# EAGLE design easyDRO_final (EAGLE 7.5.0)
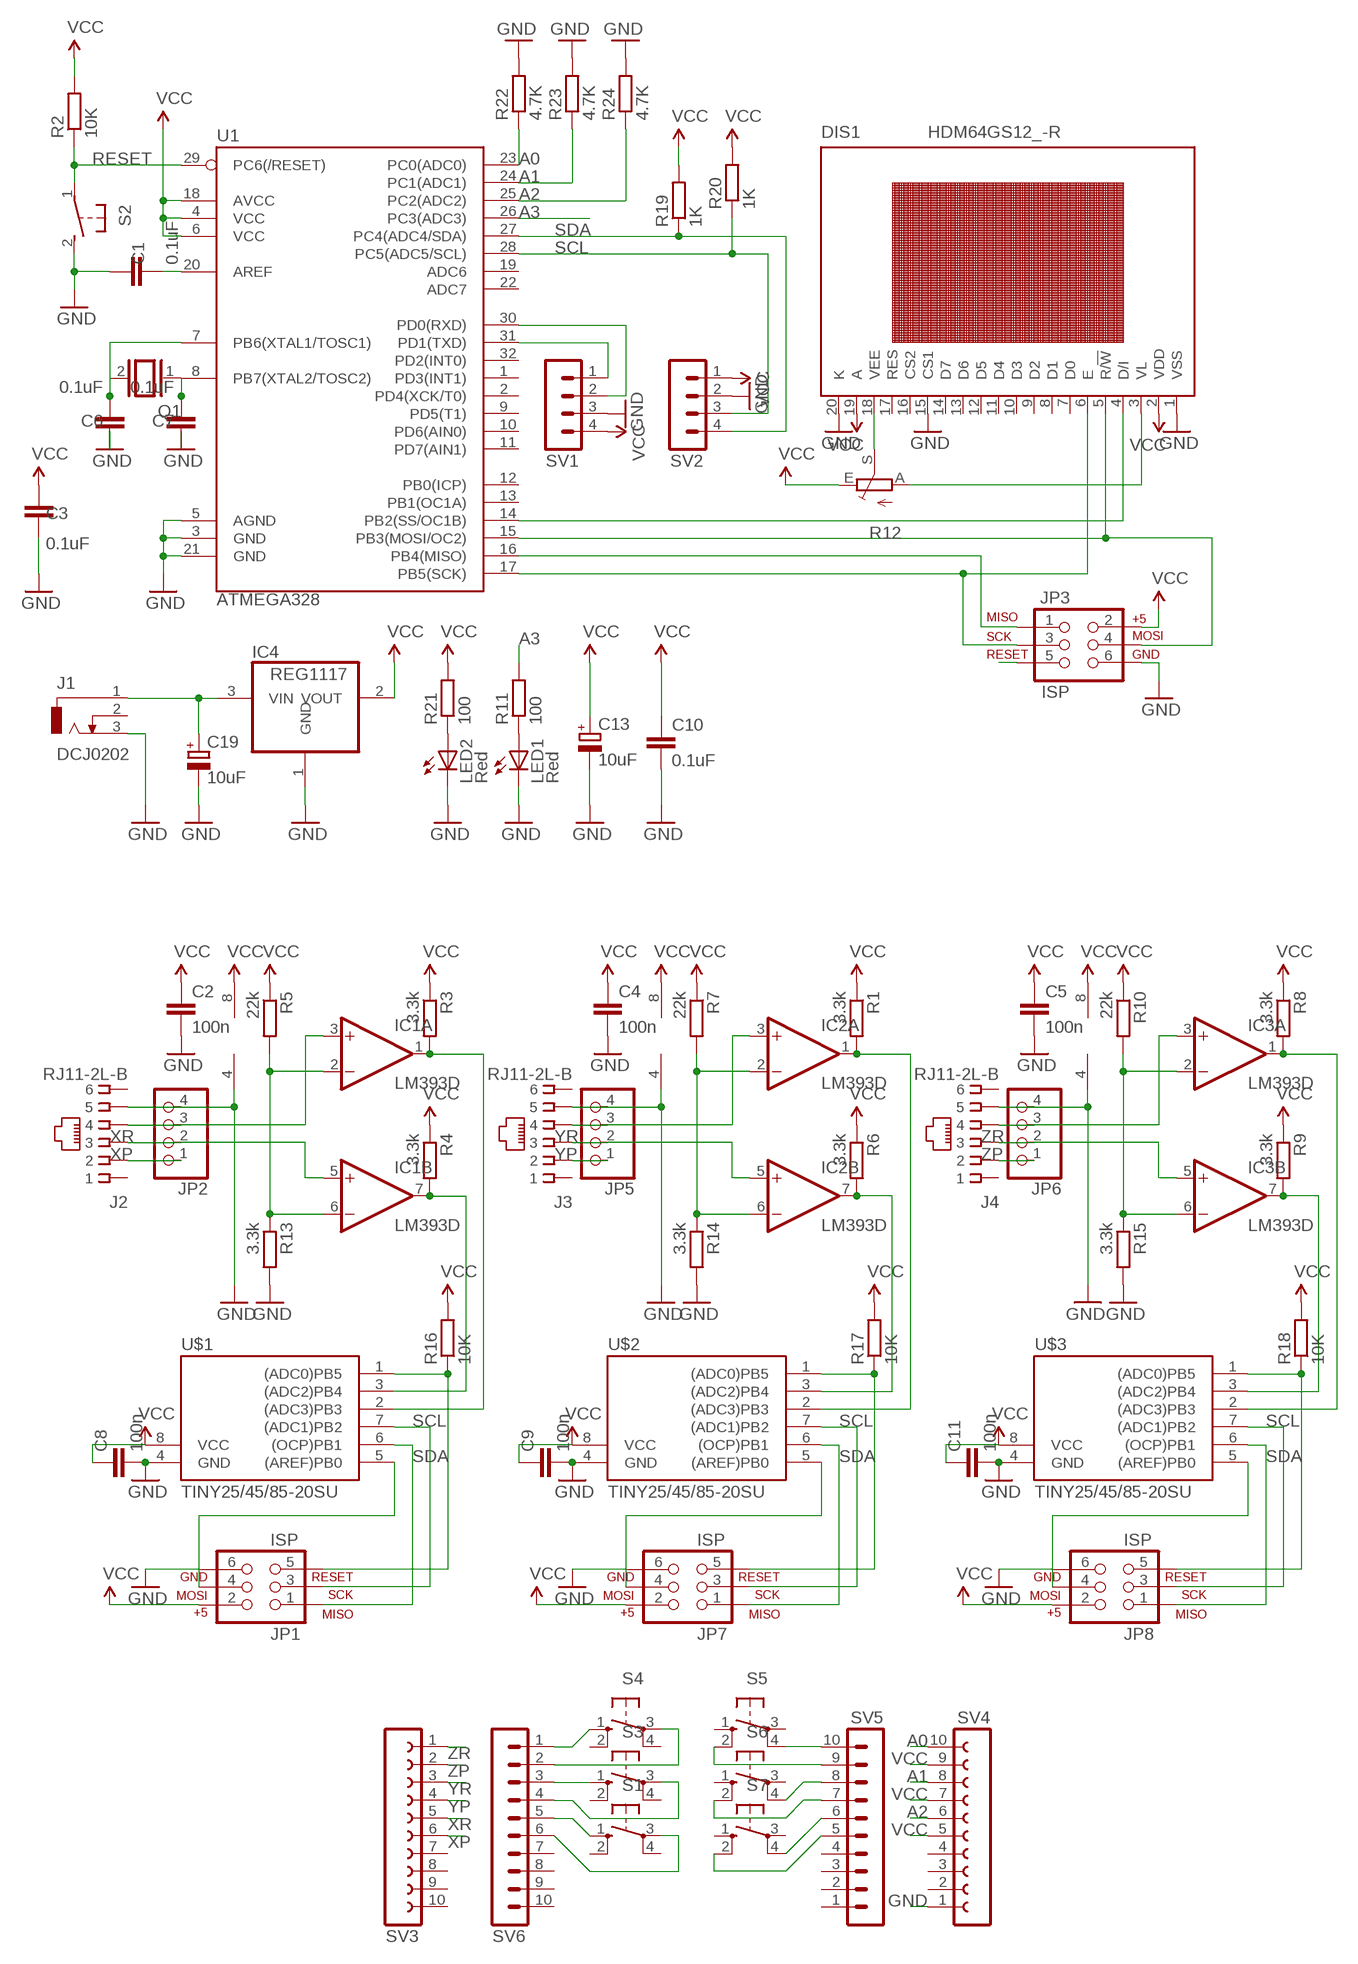
[diagram p0: schematic, sheet 1]

## Parts
C1  0.1uF  C-EUC0805  [C0805]
C2  100n  C-EUC0805  [C0805]
C3  0.1uF  C-EUC0805  [C0805]
C4  100n  C-EUC0805  [C0805]
C5  100n  C-EUC0805  [C0805]
C6  0.1uF  C-EUC0805  [C0805]
C7  0.1uF  C-EUC0805  [C0805]
C8  100n  C-EUC0805  [C0805]
C9  100n  C-EUC0805  [C0805]
C10  0.1uF  C-EUC0805  [C0805]
C11  100n  C-EUC0805  [C0805]
C13  10uF  CPOL-EUE2.5-5  [E2,5-5]
C19  10uF  CPOL-EUE2.5-5  [E2,5-5]
DIS1  HDM64GS12_-R  [HDM64GS12_-R]
IC1  LM393D  [SO08]
IC2  LM393D  [SO08]
IC3  LM393D  [SO08]
IC4  REG1117  [SOT223]
J1  DCJ0202  [DCJ0202]
J2  RJ11-2L-B  [RJ11-NO_SHIELD]
J3  RJ11-2L-B  [RJ11-NO_SHIELD]
J4  RJ11-2L-B  [RJ11-NO_SHIELD]
JP1  ISP  AVR_SPI_PRG_6PTH  [2X3]
JP2  PINHD-1X4/90  [1X04/90]
JP3  ISP  AVR_SPI_PRG_6PTH  [2X3]
JP5  PINHD-1X4/90  [1X04/90]
JP6  PINHD-1X4/90  [1X04/90]
JP7  ISP  AVR_SPI_PRG_6PTH  [2X3]
JP8  ISP  AVR_SPI_PRG_6PTH  [2X3]
LED1  Red  LED5MM  [LED5MM]
LED2  Red  LED5MM  [LED5MM]
Q1  XTAL/S  [QS]
R1  3.3k  R-EU_R0805  [R0805]
R2  10K  R-EU_R0805  [R0805]
R3  3.3k  R-EU_R0805  [R0805]
R4  3.3k  R-EU_R0805  [R0805]
R5  22k  R-EU_R0805  [R0805]
R6  3.3k  R-EU_R0805  [R0805]
R7  22k  R-EU_R0805  [R0805]
R8  3.3k  R-EU_R0805  [R0805]
R9  3.3k  R-EU_R0805  [R0805]
R10  22k  R-EU_R0805  [R0805]
R11  100  R-EU_R0805  [R0805]
R12  TRIM_EU-CA6H  [CA6H]
R13  3.3k  R-EU_R0805  [R0805]
R14  3.3k  R-EU_R0805  [R0805]
R15  3.3k  R-EU_R0805  [R0805]
R16  10K  R-EU_R0805  [R0805]
R17  10K  R-EU_R0805  [R0805]
R18  10K  R-EU_R0805  [R0805]
R19  1K  R-EU_R0805  [R0805]
R20  1K  R-EU_R0805  [R0805]
R21  100  R-EU_R0805  [R0805]
R22  4.7K  R-EU_R0805  [R0805]
R23  4.7K  R-EU_R0805  [R0805]
R24  4.7K  R-EU_R0805  [R0805]
S1  40-XX  [B3F-40XX]
S2  31-XX  [B3F-31XX]
S3  40-XX  [B3F-40XX]
S4  40-XX  [B3F-40XX]
S5  40-XX  [B3F-40XX]
S6  40-XX  [B3F-40XX]
S7  40-XX  [B3F-40XX]
SV1  MA04-1  [MA04-1]
SV2  MA04-1  [MA04-1]
SV3  FE10-1  [FE10]
SV4  FE10-1  [FE10]
SV5  MA10-1  [MA10-1]
SV6  MA10-1  [MA10-1]
U1  ATMEGA328  ATMEGA168  [TQFP32-08]
U$1  TINY25/45/85-20SU  [SOIC8]
U$2  TINY25/45/85-20SU  [SOIC8]
U$3  TINY25/45/85-20SU  [SOIC8]

## Nets
A0: R22.1 SV4.10 U1.23(PC0(ADC0))
A1: R23.1 SV4.8 U1.24(PC1(ADC1))
A2: R24.1 SV4.6 U1.25(PC2(ADC2))
A3: R11.2 U1.26(PC3(ADC3))
CLK1: IC1.7(B:OUT) R4.2 U$1.3((ADC2)PB4)
CLK2: IC2.7(B:OUT) R6.2 U$2.3((ADC2)PB4)
CLK3: IC3.7(B:OUT) R9.2 U$3.3((ADC2)PB4)
DATA1: IC1.1(A:OUT) R3.2 U$1.2((ADC3)PB3)
DATA2: IC2.1(A:OUT) R1.2 U$2.2((ADC3)PB3)
DATA3: IC3.1(A:OUT) R8.2 U$3.2((ADC3)PB3)
GND [vcc]: C1.2 C2.2 C3.1 C4.2 C5.2 C6.2 C7.2 C8.2 C9.2 C10.2 C11.2 C13.- C19.- DIS1.1(VSS) DIS1.15(CS1) DIS1.20(K) IC1.4(P:V-) IC2.4(P:V-) IC3.4(P:V-) IC4.1(GND) J1.3 J2.5 J3.5 J4.5 JP1.6 JP2.4 JP3.6 JP5.4 JP6.4 JP7.6 JP8.6 LED1.K(C) LED2.K(C) R13.2 R14.2 R15.2 R22.2 R23.2 R24.2 S2.2(S) SV1.3 SV2.2 SV4.1 U1.3(GND) U1.5(AGND) U1.21(GND) U$1.4(GND) U$2.4(GND) U$3.4(GND)
N$1: IC1.2(A:-IN) IC1.6(B:-IN) R5.2 R13.1
N$2: DIS1.6(E) JP3.3 U1.17(PB5(SCK))
N$3: DIS1.5(R/!W) JP3.4 U1.15(PB3(MOSI/OC2))
N$4: DIS1.4(D/I) U1.14(PB2(SS/OC1B))
N$5: C7.1 Q1.1 U1.8(PB7(XTAL2/TOSC2))
N$6: C1.1 U1.20(AREF)
N$7: C6.1 Q1.2 U1.7(PB6(XTAL1/TOSC1))
N$8: JP1.1 U$1.6((OCP)PB1)
N$9: JP1.5 R16.1 U$1.1((ADC0)PB5)
N$10: JP7.1 U$2.6((OCP)PB1)
N$11: JP7.5 R17.1 U$2.1((ADC0)PB5)
N$12: JP8.1 U$3.6((OCP)PB1)
N$13: JP8.5 R18.1 U$3.1((ADC0)PB5)
N$14: SV1.1 U1.31(PD1(TXD))
N$15: JP3.1 U1.16(PB4(MISO))
N$16: DIS1.18(VEE) R12.S
N$17: DIS1.3(VL) R12.A
N$18: S5.4(P1) SV5.10
N$19: IC1.3(A:+IN) J2.4 JP2.3
N$20: IC2.2(A:-IN) IC2.6(B:-IN) R7.2 R14.1
N$21: S5.2(S1) SV5.9
N$22: SV1.2 U1.30(PD0(RXD))
N$23: LED2.A R21.1
N$24: S6.4(P1) SV5.8
N$25: IC2.3(A:+IN) J3.4 JP5.3
N$26: S6.2(S1) SV5.7
N$27: IC3.2(A:-IN) IC3.6(B:-IN) R10.2 R15.1
N$28: S7.4(P1) SV5.6
N$29: S7.2(S1) SV5.5
N$30: S4.1(S) SV6.1
N$31: IC3.3(A:+IN) J4.4 JP6.3
N$32: S4.3(P) SV6.2
N$33: S3.1(S) SV6.3
N$34: S3.3(P) SV6.4
N$36: S1.1(S) SV6.5
N$37: S1.3(P) SV6.6
N$38: LED1.A R11.1
RESET: JP3.5 R2.1 S2.1(P) U1.29(PC6(/RESET))
SCL: JP1.3 JP7.3 JP8.3 R20.1 SV2.3 U1.28(PC5(ADC5/SCL)) U$1.7((ADC1)PB2) U$2.7((ADC1)PB2) U$3.7((ADC1)PB2)
SDA: JP1.4 JP7.4 JP8.4 R19.1 SV2.4 U1.27(PC4(ADC4/SDA)) U$1.5((AREF)PB0) U$2.5((AREF)PB0) U$3.5((AREF)PB0)
VCC: C2.1 C3.2 C4.1 C5.1 C8.1 C9.1 C10.1 C11.1 C13.+ DIS1.2(VDD) DIS1.19(A) IC1.8(P:V+) IC2.8(P:V+) IC3.8(P:V+) IC4.2(VOUT) JP1.2 JP3.2 JP7.2 JP8.2 R1.1 R2.2 R3.1 R4.1 R5.1 R6.1 R7.1 R8.1 R9.1 R10.1 R12.E R16.2 R17.2 R18.2 R19.2 R20.2 R21.2 SV1.4 SV2.1 SV4.5 SV4.7 SV4.9 U1.4(VCC) U1.6(VCC) U1.18(AVCC) U$1.8(VCC) U$2.8(VCC) U$3.8(VCC)
VIN [vcc]: C19.+ IC4.3(VIN) J1.1
XP: J2.2 JP2.1 SV3.6
XR: IC1.5(B:+IN) J2.3 JP2.2 SV3.5
YP: J3.2 JP5.1 SV3.4
YR: IC2.5(B:+IN) J3.3 JP5.2 SV3.3
ZP: J4.2 JP6.1 SV3.2
ZR: IC3.5(B:+IN) J4.3 JP6.2 SV3.1
Unconnected: DIS1.7(D0) DIS1.8(D1) DIS1.9(D2) DIS1.10(D3) DIS1.11(D4) DIS1.12(D5) DIS1.13(D6) DIS1.14(D7) DIS1.16(CS2) DIS1.17(RES) J1.2 J2.1 J2.6 J3.1 J3.6 J4.1 J4.6 S1.2(S1) S1.4(P1) S3.2(S1) S3.4(P1) S4.2(S1) S4.4(P1) S5.1(S) S5.3(P) S6.1(S) S6.3(P) S7.1(S) S7.3(P) SV3.7 SV3.8 SV3.9 SV3.10 SV4.2 SV4.3 SV4.4 SV5.1 SV5.2 SV5.3 SV5.4 SV6.7 SV6.8 SV6.9 SV6.10 U1.1(PD3(INT1)) U1.2(PD4(XCK/T0)) U1.9(PD5(T1)) U1.10(PD6(AIN0)) U1.11(PD7(AIN1)) U1.12(PB0(ICP)) U1.13(PB1(OC1A)) U1.19(ADC6) U1.22(ADC7) U1.32(PD2(INT0))

## Library data of the parts
C1-C9 C11 = resistor:C-EU: CAPACITOR, European symbol
C10 = rcl:C-EU: CAPACITOR, European symbol
C13 C19 = rcl:CPOL-EU: POLARIZED CAPACITOR, European symbol
DIS1 = display-lcd:HDM64GS12_-R: HDM64GS12_-R 128 X 64 Dots Graphic Source: http://www.hantronix.com/down/64gs12-r.pdf; OC_FARNELL: unknown; OC_NEWARK: unknown
IC1-IC3 = linear:LM393: COMPARATOR
IC4 = burr-brown:REG1117: 800mA and 1A Low Dropout (LDO) Positive Regulator 1.8V, 2.5V, 2.85V, 3.3V, 5V, and Adj; MPN: REG1117; OC_FARNELL: 1097566; OC_NEWARK: 14P6981
J1 = con-jack-igi:DCJ0202: DC POWER JACK Source: DCJ0202.pdf; OC_FARNELL: unknown; OC_NEWARK: unknown
J2-J4 = con-tycoelectronics:RJ11: CORCOM Modular RJ Jacks No Shield Source: www.tycoelectronics.com .. ENG_DS_1654001_1099_RJ_L_0507.pdf; MF: TYCO ELECTRONICS; MPN: RJ11-2L-B; OC_FARNELL: unknown; OC_NEWARK: 83F4463
JP1 JP3 JP7 JP8 = SparkFun:AVR_SPI_PRG_6: AVR ISP 6 Pin This is the reduced ISP connector for AVR programming. Common on Arduino. This footprint will take up less PCB space and can be used with a 10-pin to 6-pin adapter such as SKU: BOB-08508
JP2 JP5 JP6 = pinhead:PINHD-1X4: PIN HEADER
LED1 LED2 = led:LED: LED OSRAM: - CHIPLED LG R971, LG N971, LY N971, LG Q971, LY Q971, LO R971, LY R971 LH N974, LH R974 LS Q976, LO Q976, LY Q976 LO Q996 - Hyper CHIPLED LW Q18S LB Q993, LB Q99A, LB R99A - SideLED LS A670, LO A670, LY A670, LG A670, LP A670 LB A673, LV A673, LT A673, LW A673 LH A674 LY A675 LS A676, LA A676, LO A676, LY A676, LW A676 LS A679, LY A679, LG A679 - Hyper Micro SIDELED® LS Y876, LA Y876, LO Y876, LY Y876 LT Y87S - SmartLED LW L88C, LW L88S LB L89C, LB L89S, LG L890 LS L89K, LO L89K, LY L89K LS L896, LA L896, LO L896, LY L896 - TOPLED LS T670, LO T670, LY T670, LG T670, LP T670 LSG T670, LSP T670, LSY T670, LOP T670, LYG T670 LG T671, LOG T671, LSG T671 LB T673, LV T673, LT T673, LW T673 LH T674 LS T676, LA T676, LO T676, LY T676, LB T676, LH T676, LSB T676, LW T676 LB T67C, LV T67C, LT T67C, LS T67K, LO T67K, LY T67K, LW E67C LS E67B, LA E67B, LO E67B, LY E67B, LB E67C, LV E67C, LT E67C LW T67C LS T679, LY T679, LG T679 LS T770, LO T770, LY T770, LG T770, LP T770 LB T773, LV T773, LT T773, LW T773 LH T774 LS E675, LA E675, LY E675, LS T675 LS T776, LA T776, LO T776, LY T776, LB T776 LHGB T686 LT T68C, LB T68C - Hyper Mini TOPLED® LB M676 - Mini TOPLED Santana® LG M470 LS M47K, LO M47K, LY M47K Source: http://www.osram.convergy.de LUXEON: - LUMILED® LXK2-PW12-R00, LXK2-PW12-S00, LXK2-PW14-U00, LXK2-PW14-V00 LXK2-PM12-R00, LXK2-PM12-S00, LXK2-PM14-U00 LXK2-PE12-Q00, LXK2-PE12-R00, LXK2-PE12-S00, LXK2-PE14-T00, LXK2-PE14-U00 LXK2-PB12-K00, LXK2-PB12-L00, LXK2-PB12-M00, LXK2-PB14-N00, LXK2-PB14-P00, LXK2-PB14-Q00 LXK2-PR12-L00, LXK2-PR12-M00, LXK2-PR14-Q00, LXK2-PR14-R00 LXK2-PD12-Q00, LXK2-PD12-R00, LXK2-PD12-S00 LXK2-PH12-R00, LXK2-PH12-S00 LXK2-PL12-P00, LXK2-PL12-Q00, LXK2-PL12-R00 Source: www.luxeon.com KINGBRIGHT: KA-3528ASYC Source: www.kingbright.com
Q1 = special:XTAL/S: CRYSTAL
R1-R11 R14-R24 = resistor:R-EU_: RESISTOR, European symbol
R12 = pot:TRIM_EU-: POTENTIOMETER
R13 = rcl:R-EU_: RESISTOR, European symbol
S1 S3-S7 = switch-omron:40-XX: OMRON SWITCH; MF: OMRON COMPONENTS USA; MPN: B3F-4000; OC_FARNELL: 176434; OC_NEWARK: 36K3105
S2 = switch-omron:31-XX: OMRON SWITCH; MPN: B3F-3100; OC_FARNELL: 959704; OC_NEWARK: 36M3582
SV1 SV2 = con-lstb:MA04-1: PIN HEADER; OC_FARNELL: unknown; OC_NEWARK: unknown
SV3 SV4 = con-lsta:FE10-1: FEMALE HEADER; OC_FARNELL: unknown; OC_NEWARK: unknown
SV5 SV6 = con-lstb:MA10-1: PIN HEADER; OC_FARNELL: unknown; OC_NEWARK: unknown
U1 = SparkFun:ATMEGA168
U$1-U$3 = avr-6:TINY25/45/85

## Net classes
0 default: width 0.203 mm
1 vcc: width 0.254 mm

## Board
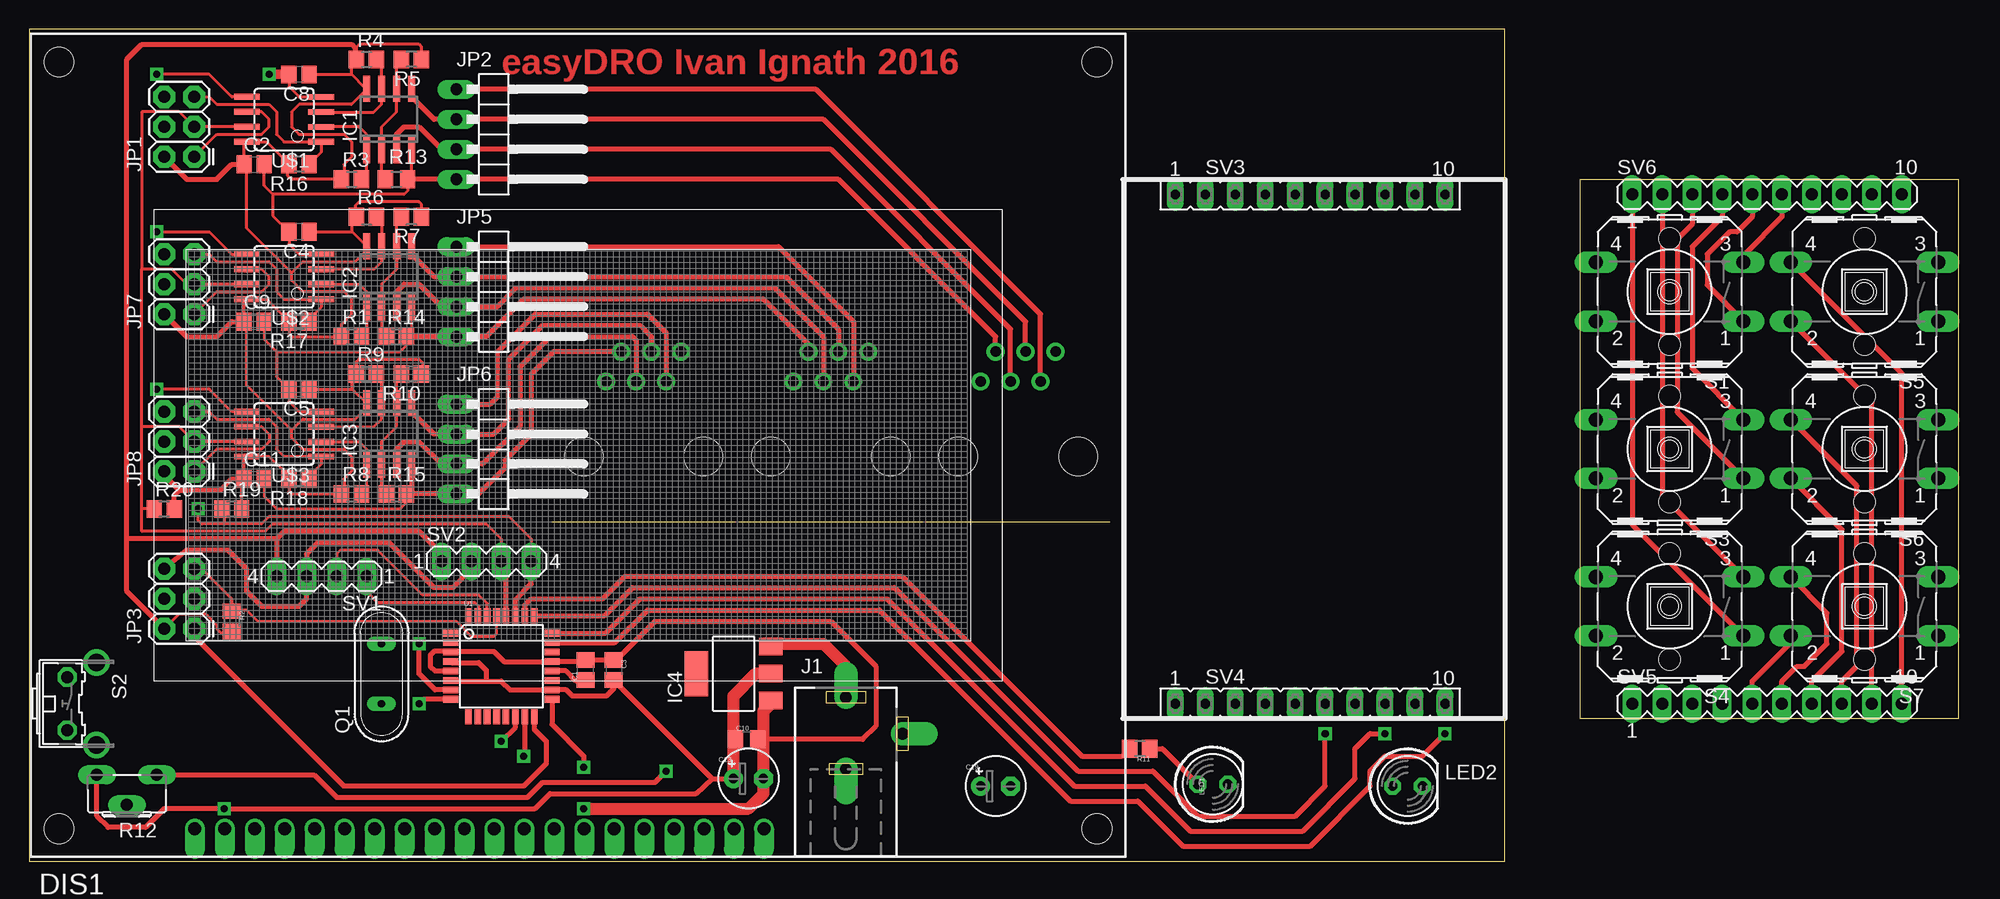
[diagram p1: board, top side]
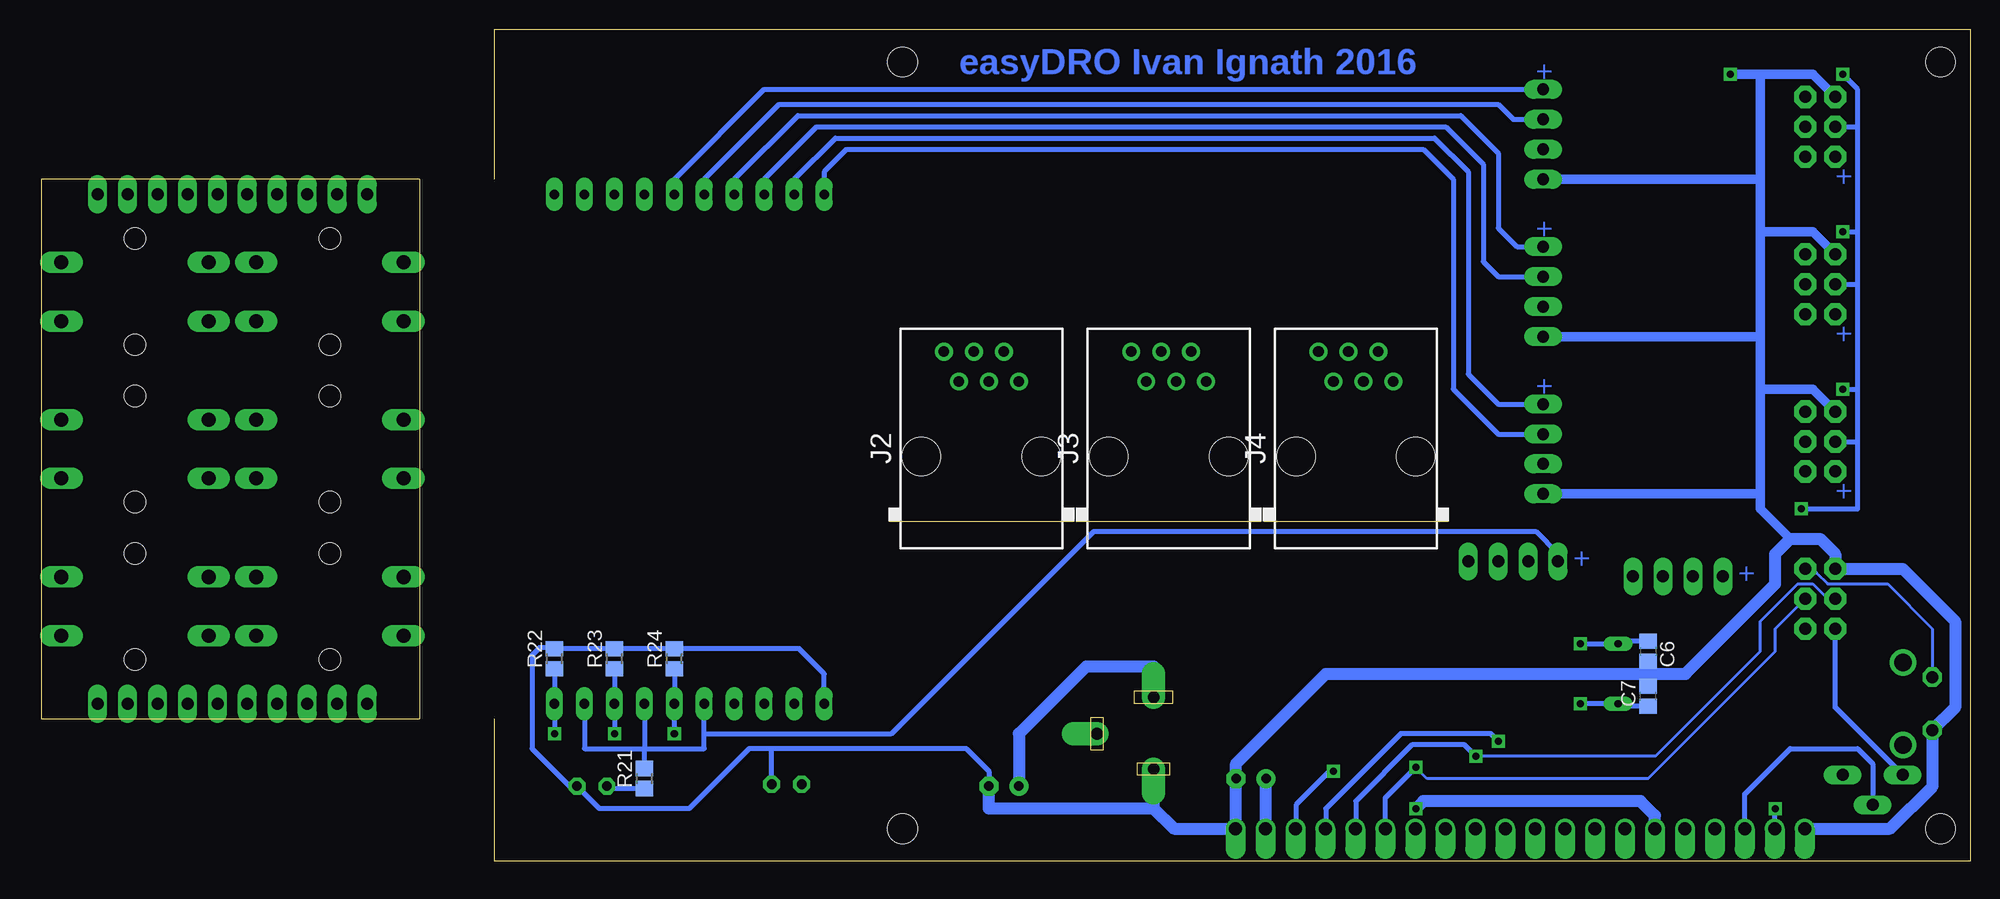
[diagram p2: board, bottom side, seen from below]

Size 163.51 x 70.48 mm. Coordinates in mm from the lower left corner, seen from the top.
Outline: 125.09,12.06 125.09,0 0,0 0,70.48 125.09,70.48 125.09,57.78
Outline: 131.44,57.78 131.44,12.06 163.51,12.06 163.51,57.78 131.44,57.78
Copper layers (1*16): Top 0.035mm / dielectric 1.5mm / Bottom 0.035mm
Design rules "SparkFun": minimum track width 8mil, minimum drill 20mil, track to track 8mil, track to pad 8mil, pad to pad 8mil, via to via 8mil, smd to smd 8mil, copper to edge 10mil, drill to drill 8mil, minimum pad ring 12mil, minimum via ring 10mil, stop-mask expansion 4mil, vias tented up to drill 20mil, thermal gap 10mil

### Footprints (pad centres in the part's own frame; a part is rotated, then mirrored left to right if it is on the bottom)
C0805 = smd 1.3 x 1.5: 1 -0.85,0; 2 0.85,0
C0805' = smd 1.3 x 1.5: 1 -0.95,0; 2 0.95,0
E2,5-5 = drill 0.813 pad 1.6: + -1.27,0 | drill 0.813 pad 1.6 octagon: - 1.27,0
HDM64GS12_-R = drill 1.1 offset: 1 15.76,-32.5; 2 13.22,-32.5; 3 10.68,-32.5; 4 8.14,-32.5; 5 5.6,-32.5; 6 3.06,-32.5; 7 0.52,-32.5; 8 -2.02,-32.5; 9 -4.56,-32.5; 10 -7.1,-32.5; 11 -9.64,-32.5; 12 -12.18,-32.5; 13 -14.72,-32.5; 14 -17.26,-32.5; 15 -19.8,-32.5; 16 -22.34,-32.5; 17 -24.88,-32.5; 18 -27.42,-32.5; 19 -29.96,-32.5; 20 -32.5,-32.5 | hole 2.5: -44,-32.5; 44,-32.5; -44,32.5; 44,32.5
SO08 = smd 0.6 x 2.2: 1 -1.905,-2.6; 2 -0.635,-2.6; 3 0.635,-2.6; 4 1.905,-2.6; 5 1.905,2.6; 6 0.635,2.6; 7 -0.635,2.6; 8 -1.905,2.6
SOT223 = smd 1.499 x 2.007: 1 -2.261,-3.15; 2 0.025,-3.15; 3 2.311,-3.15 | smd 3.81 x 2.007: 4 0,3.15
DCJ0202 = drill 1 pad 2 offset: 1 0,3.1; 2 4.8,0; 3 0,-3
RJ11-NO_SHIELD = drill 0.9 pad 1.4: 1 -3.175,8.89; 2 -1.905,6.35; 3 -0.635,8.89; 4 0.635,6.35; 5 1.905,8.89; 6 3.175,6.35 | hole 3.251: -5.08,0; 5.08,0
2X3 = drill 1.016 pad 1.88 octagon: 1 0,0; 2 0,2.54; 3 2.54,0; 4 2.54,2.54; 5 5.08,0; 6 5.08,2.54
1X04/90 = drill 1.016 long: 1 -3.81,-3.81; 2 -1.27,-3.81; 3 1.27,-3.81; 4 3.81,-3.81
LED5MM = drill 0.813 octagon: A -1.27,0; K 1.27,0
QS = drill 0.61 long: 1 -2.54,0; 2 2.54,0
R0805 = smd 1.3 x 1.5: 1 -0.85,0; 2 0.85,0
CA6H = drill 1.016 long: A -2.54,0; E 2.54,0; S 0,2.54
R0805' = smd 1.3 x 1.5: 1 -0.95,0; 2 0.95,0
B3F-40XX = drill 1.194 long: 1 -6.248,2.489; 2 6.248,2.489; 3 -6.248,-2.489; 4 6.248,-2.489 | hole 1.803: 0,-4.496; 0,4.496
B3F-31XX = drill 1.016 octagon: 1 -2.261,-1.245; 2 2.261,-1.245 | drill 1.499 pad 2.159: 3 -3.505,1.245; 4 3.505,1.245
MA04-1 = drill 1.016 long: 1 -3.81,0; 2 -1.27,0; 3 1.27,0; 4 3.81,0
FE10 = drill 0.813 long: 1 -11.43,0; 2 -8.89,0; 3 -6.35,0; 4 -3.81,0; 5 -1.27,0; 6 1.27,0; 7 3.81,0; 8 6.35,0; 9 8.89,0; 10 11.43,0
MA10-1 = drill 1.016 long: 1 -11.43,0; 2 -8.89,0; 3 -6.35,0; 4 -3.81,0; 5 -1.27,0; 6 1.27,0; 7 3.81,0; 8 6.35,0; 9 8.89,0; 10 11.43,0
TQFP32-08 = smd 1.27 x 0.559: 1 -4.293,2.8; 2 -4.293,2; 3 -4.293,1.2; 4 -4.293,0.4; 5 -4.293,-0.4; 6 -4.293,-1.2; 7 -4.293,-2; 8 -4.293,-2.8; 17 4.293,-2.8; 18 4.293,-2; 19 4.293,-1.2; 20 4.293,-0.4; 21 4.293,0.4; 22 4.293,1.2; 23 4.293,2; 24 4.293,2.8 | smd 0.559 x 1.27: 9 -2.8,-4.293; 10 -2,-4.293; 11 -1.2,-4.293; 12 -0.4,-4.293; 13 0.4,-4.293; 14 1.2,-4.293; 15 2,-4.293; 16 2.8,-4.293; 25 2.8,4.293; 26 2,4.293; 27 1.2,4.293; 28 0.4,4.293; 29 -0.4,4.293; 30 -1.2,4.293; 31 -2,4.293; 32 -2.8,4.293
SOIC8 = smd 0.5 x 2.2: 1 -1.905,-3.154; 2 -0.645,-3.154; 3 0.625,-3.154; 4 1.895,-3.154; 5 1.905,3.154; 6 0.635,3.154; 7 -0.635,3.154; 8 -1.905,3.154

### Placement (x,y rotation side)
C1  47.15,16.19 90 top
C2  19.05,59.05 0 top
C3  49.53,16.19 270 top
C4  22.86,53.34 180 top
C5  22.86,40.01 180 top
C6  27.3,17.78 270 bottom
C7  27.3,13.97 90 bottom
C8  22.86,66.67 180 top
C9  19.05,45.72 0 top
C10  0.1uF  [C0805']  60.8,10.32 0 top
C11  19.05,32.38 0 top
C13  60.96,6.99 0 top
C19  81.92,6.35 0 top
DIS1  46.51,35.24 0 top
IC1  30.48,62.87 0 top
IC2  30.48,49.53 0 top
IC3  30.48,36.2 0 top
IC4  59.69,15.88 90 top
J1  69.22,10.79 0 top
J2  83.82,34.29 0 bottom
J3  67.94,34.29 0 bottom
J4  52.07,34.29 0 bottom
JP1  13.97,59.69 90 top
JP2  40.01,61.59 270 top
JP3  13.97,19.68 90 top
JP5  40.01,48.26 270 top
JP6  40.01,34.92 270 top
JP7  13.97,46.35 90 top
JP8  13.97,33.02 90 top
LED1  100.33,6.51 0 top
LED2  116.84,6.35 0 top
Q1  29.84,15.88 90 top
R1  27.3,44.45 0 top
R2  17.14,20.32 270 top
R3  27.3,57.78 0 top
R4  28.57,67.94 0 top
R5  32.38,67.94 180 top
R6  28.57,54.61 0 top
R7  32.38,54.61 180 top
R8  27.3,31.11 0 top
R9  28.57,41.27 0 top
R10  32.38,41.27 180 top
R11  94.14,9.53 180 top
R12  8.26,7.3 180 top
R13  3.3k  [R0805']  31.11,57.78 0 top
R14  31.11,44.45 0 top
R15  31.11,31.11 0 top
R16  22.86,59.05 180 top
R17  22.86,45.72 180 top
R18  22.86,32.38 180 top
R19  17.14,29.84 0 top
R20  11.43,29.84 0 top
R21  112.39,6.99 90 bottom
R22  120.02,17.14 90 bottom
R23  114.94,17.14 90 bottom
R24  109.86,17.14 90 bottom
S1  139.06,48.26 180 top
S2  4.45,13.34 270 top
S3  139.06,34.92 180 top
S4  139.06,21.59 180 top
S5  155.57,48.26 180 top
S6  155.57,34.92 180 top
S7  155.57,21.59 180 top
SV1  24.77,24.13 180 top
SV2  38.73,25.4 0 top
SV3  108.58,56.52 0 top
SV4  108.58,13.34 0 top
SV5  147.32,13.34 0 top
SV6  147.32,56.52 0 top
U1  40.01,16.51 0 top
U$1  21.59,62.87 90 top
U$2  21.59,49.53 90 top
U$3  21.59,36.2 90 top

### Tracks (layer width: path | path; a pad name or v marks a point on that pad's centre or on a via)
A0  (via drill 0.6)
  Top 0.406: U1.23 49.62,18.51 52.39,21.27 72.07,21.27 88.27,5.08 93.98,5.08 97.79,1.27 108.58,1.27 113.67,6.35 113.67,7.62 114.94,8.89 118.11,8.89 v120.02,10.79
  Bottom 0.406: v120.02,10.79 SV4.10 R22.1
A1  (via drill 0.6)
  Top 0.406: U1.24 48.84,19.31 51.75,22.23 72.71,22.23 88.58,6.35 94.61,6.35 98.42,2.54 107.95,2.54 112.39,6.99 112.39,9.53 113.67,10.79 v114.94,10.79
  Bottom 0.406: v114.94,10.79 SV4.8 R23.1
A2  (via drill 0.6)
  Top 0.406: U1.25 48.74,20.8 51.12,23.18 73.34,23.18 88.9,7.62 95.25,7.62 99.06,3.81 107.31,3.81 109.86,6.35 v109.86,10.79
  Bottom 0.406: v109.86,10.79 SV4.6 R24.1
A3
  Top 0.406: U1.26 42.01,21.68 42.55,22.23 48.58,22.23 50.48,24.13 73.98,24.13 89.22,8.89 92.65,8.89 R11.2
CLK1
  Top 0.254: U$1.3 29.2,63.49 29.84,64.14 IC1.7 29.84,67.53 R4.2
CLK2
  Top 0.254: U$2.3 24.75,50.16 29.21,50.16 29.84,50.8 IC2.7 29.84,54.61 R6.2
CLK3
  Top 0.254: U$3.3 29.2,36.82 29.84,37.47 IC3.7 29.84,40.85 R9.2
DATA1
  Top 0.254: U$1.2 24.75,62.23 27.94,62.23 28.57,61.59 IC1.1 28.57,58.42 28.16,58 R3.2
DATA2
  Top 0.254: R1.2 28.57,44.87 IC2.1 28.57,48.26 27.95,48.88 U$2.2
DATA3
  Top 0.254: U$3.2 27.95,35.55 28.57,34.92 IC3.1 28.57,31.54
  Top 0.406: 28.57,31.54 R8.2
GND  (via drill 0.6)
  Top 0.254: U1.5 35.63,16.19 | 35.64,17.78 arc-90 U1.3 | U$3.4 22.86,38.1 22.01,38.95 C5.2 20.95,41.06 20.95,43.18 | C11.2 19.9,30.9 20.95,29.84 31.43,29.84 32.07,30.48 32.07,31.01 R15.2 | R14.2 32.38,44.87 IC2.4 32.38,44.13 31.43,43.18 20.95,43.18 | U$2.4 22.86,51.44 22.01,52.28 C4.2 20.64,54.71 20.64,56.52 | 20.32,45.3 C9.2 19.9,44.23 20.95,43.18 | C8.2 22.01,65.62 22.86,64.77 U$1.4 | IC1.4 32.38,58.42 32.06,58.1 R13.2 32.06,56.83 31.75,56.52 20.64,56.52 | 20.32,58.42 19.9,58.84 C2.2 19.9,57.25 20.64,56.52 | U1.21 44.43,17.04
  Top 0.406: IC3.4 32.38,31.54 R15.2 JP6.4 38.1,31.11 40.32,33.34 40.32,33.97 42.55,36.2 42.55,41.27 44.45,43.18 J4.5 | C10.2 70.64,10.32 71.75,11.43 71.75,16.51 67.94,20.32 53.02,20.32 50.16,17.46 49.95,17.46 C3.1 C1.2 47.02,16.91 U1.21 40.24,16.91 39.37,17.78 35.78,17.78 U1.3 | 35.64,17.78 34.29,17.78 33.97,17.46 33.97,16.51 34.37,16.11 U1.5 | R13.2 JP2.4 68.58,57.78 81.92,44.45 J2.5 | R14.2 JP5.4 38.73,44.45 41.91,47.62 62.23,47.62 66.04,43.81 J3.5 | JP3.6 13.34,26.35 16.83,26.35 18.41,24.77 18.41,22.86 19.68,21.59 22.86,21.59 23.5,22.23 SV1.3 23.5,26.04 24.45,26.99 30.48,26.99 34.29,23.18 35.88,23.18 37.47,24.77 SV2.2
  Top 0.813: C8.2 v20.32,66.67
  Top 1.016: 62.23,10.16 C13.- 62.23,5.71 60.96,4.45 v46.99,4.45 | 62.23,10.16 62.23,12.7 62.84,13.31 IC4.1 | C10.2 61.91,10.16 62.23,10.16
  Bottom 0.406: 101.6,9.53 85.09,9.53 83.19,7.62 C19.- | 101.6,9.53 103.5,9.53 108.58,4.45 116.2,4.45 LED2.K 118.75,6.35 121.92,9.53 121.92,17.46 121.28,18.1 120.12,18.1 R22.2 R23.2 R24.2 99.28,18 97.16,15.88 SV4.1 | LED1.K 101.6,9.53 | C7.2 27.3,15.88 C6.2
  Bottom 0.813: 15.24,27.3 17.78,29.84 17.78,31.11 | JP6.4 17.78,31.11 | 17.78,31.11 17.78,40.01 | 17.78,40.01 17.78,44.45 | 17.78,44.45 JP5.4 | 17.78,44.45 17.78,53.34 | 17.78,53.34 17.78,57.78 | 17.78,57.78 JP2.4 | 17.78,57.78 17.78,66.67 | 17.78,66.67 v20.32,66.67 | 17.78,66.67 13.34,66.67 JP1.6 | JP7.6 13.34,53.34 17.78,53.34 | JP8.6 13.34,40.01 17.78,40.01
  Bottom 1.016: J1.3 69.22,4.45 | 69.22,4.45 67.51,2.74 DIS1.1 62.23,2.79 C13.- 62.23,8.26 54.61,15.88 27.3,15.88 24.13,15.88 16.51,23.5 16.51,26.04 15.24,27.3 12.7,27.3 11.43,26.04 JP3.6 5.71,24.77 1.27,20.32 1.27,13.01 S2.2 3.17,11.05 3.17,6.35 6.78,2.74 DIS1.20 | DIS1.15 26.71,3.85 27.94,5.08 46.35,5.08 v46.99,4.45 | 69.22,4.45 83.19,4.45 C19.-
N$1
  Top 0.254: R5.2 31.11,67.53 IC1.6 31.11,63.5 29.84,62.23 IC1.2 29.84,57.78 R13.1
N$2  (via drill 0.6)
  Top 0.406: U1.17 44.3,11.58 46.99,8.89 v46.99,7.94
  Bottom 0.254: JP3.3 16.51,19.68 16.51,17.78 27.3,6.99 46.04,6.99 v46.99,7.94
  Bottom 0.406: DIS1.6 49.57,5.35 v46.99,7.94
N$3  (via drill 0.6)
  Top 0.406: v41.91,8.89 arc90 42.01,8.98 U1.15
  Bottom 0.254: JP3.4 12.06,22.23 13.34,23.5 14.61,23.5 17.78,20.32 17.78,17.78 26.67,8.89 v41.91,8.89
  Bottom 0.406: v41.91,8.89 42.86,9.84 47.31,9.84 52.07,5.08 52.07,2.79 DIS1.5
N$4  (via drill 0.6)
  Top 0.254: 41.27,12.15 U1.14
  Top 0.406: v40.01,10.16 41.2,11.36 U1.14
  Bottom 0.406: v40.01,10.16 40.64,10.79 48.26,10.79 54.61,4.45 54.61,2.79 DIS1.4
N$5  (via drill 0.6)
  Top 0.406: U1.8 33.4,13.71 v33.02,13.34
  Bottom 0.406: C7.1 29.63,13.12 Q1.1 v33.02,13.34
N$6
  Top 0.406: C1.1 47.05,15.24 46.35,15.24 45.48,16.11 U1.20
N$7  (via drill 0.6)
  Top 0.406: U1.7 34.38,14.51 33.02,15.88 v33.02,18.41
  Bottom 0.406: v33.02,18.41 Q1.2 29.63,18.63 C6.1
N$8
  Top 0.254: JP1.1 15.88,61.59 19.68,61.59 20.32,62.23 20.32,62.87 19.68,63.5 U$1.6
N$9
  Top 0.254: JP1.5 15.24,64.77 15.88,64.14 20.32,64.14 20.95,63.5 20.95,61.59 21.59,60.96 U$1.1 24.74,60.09 R16.1
N$10
  Top 0.254: JP7.1 15.88,48.26 19.68,48.26 20.32,48.9 20.32,49.53 19.68,50.16 U$2.6
N$11
  Top 0.254: JP7.5 15.24,51.44 15.88,50.8 20.32,50.8 20.95,50.16 20.95,48.26 21.59,47.62 U$2.1 24.77,47.6 24.77,46.99 23.71,45.94 R17.1
N$12
  Top 0.254: U$3.6 19.68,36.83 20.32,36.2 20.32,35.56 19.68,34.92 15.88,34.92 JP8.1
N$13
  Top 0.254: JP8.5 15.24,38.1 15.88,37.47 20.32,37.47 20.95,36.83 20.95,34.92 21.59,34.29 U$3.1 24.77,34.27 24.77,33.66 23.71,32.6 R18.1
N$14
  Top 0.254: U1.31 38.1,20.9 38.1,21.59 37.78,21.91 29.53,21.91 28.57,22.86 SV1.1
N$15
  Top 0.406: JP3.1 13.97,19.05 26.67,6.35 41.91,6.35 43.81,8.26 43.81,10.16 42.8,11.17 U1.16
N$16
  Bottom 0.406: DIS1.18 19.09,5.67 15.24,9.53 9.53,9.53 8.26,8.26 R12.S
N$17  (via drill 0.6)
  Top 0.406: R12.A 24.13,7.3 26.04,5.4 42.23,5.4 43.5,6.67 53.02,6.67 v53.98,7.62
  Bottom 0.406: v53.98,7.62 54.29,7.62 57.15,4.76 57.15,2.79 DIS1.3
N$18
  Top 0.406: SV5.10 158.75,41.33 S5.4
N$19
  Top 0.406: IC1.3 31.11,61.59 31.75,62.23 33.02,62.23 34.92,60.33 JP2.3 67.94,60.33 83.19,45.09 J2.4
N$20
  Top 0.254: R14.1 29.84,44.87 IC2.2 29.84,48.9 31.11,50.16 IC2.6 31.11,54.19 R7.2
N$21
  Top 0.406: SV5.9 156.21,38.89 S5.2
N$22
  Top 0.254: U1.30 38.8,21.84 38.1,22.54 33.34,22.54 29.53,26.35 26.35,26.35 26.04,26.04 SV1.2
N$23
  Bottom 0.406: R21.1 115.36,6.13 LED2.A
N$24
  Top 0.406: SV5.8 153.67,15.24 154.94,16.51 154.94,31.8 S6.4
N$25
  Top 0.406: IC2.3 31.11,48.26 31.75,48.9 33.02,48.9 34.92,46.99 JP5.3 39.69,46.99 41.27,48.58 63.18,48.58 67.31,44.45 J3.4
N$26
  Top 0.406: SV5.7 151.13,15.24 153.67,17.78 153.67,28.09 S6.2
N$27
  Top 0.254: 29.84,31.54 IC3.2 29.84,35.56 31.11,36.83 IC3.6 31.11,40.85 R10.2
  Top 0.406: 29.84,31.54 R15.1
N$28
  Top 0.406: SV5.6 148.59,15.24 149.86,16.51 150.5,16.51 152.4,18.41 152.4,21.01 S7.4
N$29
  Top 0.406: SV5.5 146.05,15.24 149.33,18.52 S7.2
N$30
  Top 0.406: SV6.1 135.89,28.52 S4.1
N$31
  Top 0.406: IC3.3 31.11,34.92 31.75,35.56 33.02,35.56 34.92,33.66 JP6.3 38.42,33.66 41.59,36.83 41.59,41.91 44.13,44.45 51.12,44.45 51.44,44.13 J4.4
N$32
  Top 0.406: SV6.2 138.43,30.96 S4.3
N$33
  Top 0.406: SV6.3 140.97,53.98 139.7,52.7 139.7,38.05 S3.1
N$34
  Top 0.406: SV6.4 143.51,54.61 140.97,52.07 140.97,41.76 S3.3
N$36
  Top 0.406: SV6.5 146.05,54.61 144.78,53.34 144.15,53.34 142.24,51.44 142.24,48.84 S1.1
N$37
  Top 0.406: SV6.6 148.59,54.61 145.41,51.44 145.41,50.85 S1.3
N$38
  Top 0.406: R11.1 96.04,9.53 LED1.A
RESET
  Top 0.254: U1.29 39.6,19.29 39.37,19.05 37.47,19.05 36.2,20.32 19.37,20.32 18.41,21.27 17.36,21.27 R2.1 17.14,22.23 14.61,24.77 JP3.5
  Bottom 0.254: JP3.5 13.65,24.45 13.02,24.45 12.06,23.5 6.99,23.5 3.2,19.71 S2.1
SCL
  Top 0.254: 9.53,36.83 12.7,36.83 JP8.3 U$3.7 | 9.53,36.83 9.53,50.16 | U$2.7 JP7.3 13.34,48.9 12.06,50.16 9.53,50.16 | U$1.7 JP1.3 12.7,63.5 9.53,63.5 9.53,50.16 | 9.53,29.84 9.53,27.94 20,27.94 20.64,28.57 38.73,28.57 40.01,27.3 SV2.3 | 9.53,29.84 9.53,36.83 | R20.1 9.53,29.84
  Top 0.406: U1.28 40.41,25 SV2.3
SDA  (via drill 0.6)
  Top 0.254: U$3.5 17.14,38.1 15.24,40.01 v10.79,40.01 | v10.79,53.34 15.24,53.34 17.14,51.44 U$2.5 | U$1.5 17.14,64.77 15.24,66.67 v10.79,66.67 | 16.51,28.57 19.68,28.57 20.32,29.21 40.64,29.21 42.55,27.3 SV2.4 | 16.51,28.57 14.61,28.57 14.29,28.89 v14.29,29.84 | R19.1 16.51,29.63 16.51,28.57
  Top 0.406: U1.27 41.2,22.16 42.55,23.5 SV2.4
  Bottom 0.406: v14.29,29.84 9.53,29.84 9.53,35.56 | JP8.4 9.53,35.56 | JP1.4 9.53,62.23 | JP7.4 9.53,48.9 | 9.53,35.56 9.53,40.01 | v10.79,40.01 9.53,40.01 | 9.53,40.01 9.53,48.9 | 9.53,48.9 9.53,53.34 | v10.79,53.34 9.53,53.34 | 9.53,53.34 9.53,62.23 | 9.53,62.23 9.53,65.41 v10.79,66.67
VCC  (via drill 0.6)
  Top 0.254: U1.4 35.8,16.83 | 22.23,36.51 22.23,35.88 23.18,34.92 26.67,34.92 27.3,34.29 27.3,33.02 26.67,32.38 26.67,31.33 R8.1 22.23,31.11 22.01,31.33 R18.2 21.59,32.8 21.59,33.02 20.32,34.29 U$3.8 18.2,34.05 C11.1 18,32.18 R19.2 | C5.1 27.36,40.01 | 27.36,40.01 IC3.8 28.57,38.42 27.62,37.47 23.18,37.47 22.23,36.51 | 27.36,40.01 27.36,40.91 R9.1 27.73,42.33 27.94,42.55 33.02,42.55 33.34,42.23 33.34,41.38 R10.1 | 22.23,49.85 22.23,49.21 23.18,48.26 26.67,48.26 27.3,47.62 27.3,46.35 26.45,45.51 R1.1 22.23,44.45 22.01,44.66 R17.2 20.11,47.62 U$2.8 18.2,47.39 C9.1 18.41,45.51 18.41,40.32 22.23,36.51 | 27.3,53.34 27.3,53.98 27.73,54.4 R6.1 27.62,54.71 27.62,55.56 27.94,55.88 33.02,55.88 33.23,55.66 R7.1 | 27.3,53.34 27.36,53.34 IC2.8 28.57,51.75 27.62,50.8 23.18,50.8 22.23,49.85 | C4.1 27.3,53.34 | 27.3,66.67 28.52,65.47 IC1.8 28.57,65.41 27.3,64.14 22.86,64.14 22.23,63.5 22.23,62.23 22.86,61.59 26.67,61.59 27.3,60.96 27.3,59.69 26.67,59.05 26.67,58 R3.1 22.23,57.78 21.91,58.1 21.91,58.95 R16.2 20.11,60.96 U$1.8 18.2,60.72 C2.1 18.41,58.84 18.41,53.66 22.23,49.85 | 27.3,66.67 27.3,67.53 R4.1 27.62,68.05 27.62,68.58 | C8.1 27.3,66.67 | R5.1 33.23,69 33.02,69.22 27.94,69.22 27.62,68.9 | JP3.2 12.7,20.95 14.92,20.95 15.88,20 15.88,19.68 16.19,19.37 17.04,19.37 R2.2
  Top 0.406: 57.89,6.99 C3.2 49.53,14.61 48.9,13.97 46.04,13.97 45.5,14.51 U1.18 40.73,14.51 40.01,15.24 38.73,15.24 | 57.89,6.99 C13.+ | U1.6 35.78,15.24 38.73,15.24 | 35.8,16.83 38.1,16.83 38.73,16.19 38.73,15.24 | 57.89,6.99 56.52,5.71 44.13,5.71 42.86,4.45 v16.51,4.45 11.43,4.45 9.84,2.86 6.67,2.86 5.71,3.81 R12.E | JP3.2 8.26,22.86 8.26,27.3 | 8.26,27.3 8.26,67.94 9.53,69.22 27.3,69.22 27.62,68.9 27.62,68.58 | 20.95,27.3 8.26,27.3 | 20.95,27.3 SV1.4 | SV2.1 34.92,26.04 33.02,27.94 21.59,27.94 20.95,27.3 | JP1.2 13.34,57.78 15.88,57.78 17.14,59.05 C2.1 | JP7.2 13.34,44.45 15.88,44.45 17.14,45.72 C9.1 | JP8.2 11.43,32.7 12.7,31.43 | 12.7,31.43 16.19,31.43 17.14,32.38 C11.1 | R20.2 12.28,31.01 12.7,31.43
  Top 1.016: C13.+ 59.69,10.48 | 59.69,10.48 59.69,13.97 61.62,15.9 IC4.2 | C10.1 59.69,10.48
  Bottom 0.406: DIS1.19 16.55,4.4 v16.51,4.45 | R12.E 11.43,13.02 JP3.2 | 107.31,10.79 91.44,10.79 74.3,27.94 36.83,27.94 34.92,26.04 SV2.1 | 112.39,9.53 117.47,9.53 SV4.9 | 112.39,9.53 107.31,9.53 107.31,10.79 | R21.2 112.39,9.53 | 107.31,10.79 SV4.5 | SV4.7 112.39,9.53
  Bottom 1.016: DIS1.2 59.69,2.79 C13.+
VIN
  Top 1.016: IC4.3 63.07,18.41 67.31,18.41 69.22,16.51 J1.1
  Bottom 1.016: J1.1 69.22,16.51 74.93,16.51 80.64,10.79 C19.+
XP
  Top 0.406: J2.2 85.72,46.35 66.67,65.41 JP2.1
  Bottom 0.406: JP2.1 102.23,65.41 109.86,57.78 SV3.6
XR
  Top 0.406: J2.3 84.45,45.72 67.31,62.87 JP2.2 34.29,62.87 32.38,64.77 IC1.5
  Bottom 0.406: JP2.2 38.73,62.87 40.01,64.14 100.97,64.14 107.31,57.78 SV3.5
YP
  Top 0.406: JP5.1 63.5,52.07 69.85,45.72 J3.2
  Bottom 0.406: JP5.1 38.42,52.07 40.01,53.66 40.01,60.01 43.18,63.18 99.38,63.18 104.78,57.78 SV3.4
YR
  Top 0.406: IC2.5 32.38,51.44 34.29,49.53 JP5.2 64.14,49.53 68.58,45.09 J3.3
  Bottom 0.406: JP5.2 40.01,49.53 41.27,50.8 41.27,59.05 44.45,62.23 97.79,62.23 102.23,57.78 SV3.3
ZP
  Top 0.406: JP6.1 39.05,38.73 39.69,39.37 39.69,43.18 42.86,46.35 52.39,46.35 53.98,44.77 J4.2
  Bottom 0.406: JP6.1 40.01,38.73 42.55,41.27 42.55,58.42 45.4,61.28 96.2,61.28 99.69,57.78 SV3.2
ZR
  Top 0.406: J4.3 52.7,44.45 51.75,45.4 43.5,45.4 40.64,42.55 40.64,37.47 39.37,36.2 JP6.2 34.29,36.2 32.38,38.1 IC3.5
  Bottom 0.406: JP6.2 40.01,36.2 43.81,40.01 43.81,57.78 46.35,60.33 95.25,60.33 97.16,58.42 SV3.1

### Text on the board
Top: easyDRO Ivan Ignath 2016
Bottom: easyDRO Ivan Ignath 2016 | + | + | + | + | + | + | + | +